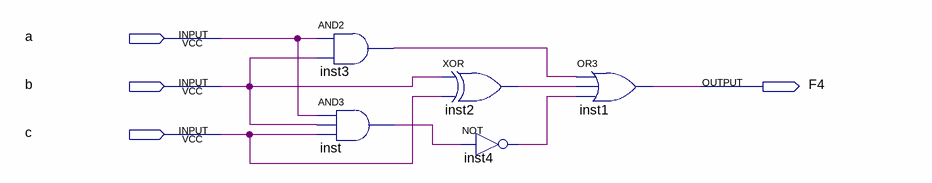
[diagram p0: schematic sheet]
// Quartus schematic Sistema04.bdf as structural Verilog: 5 symbols, 4 pins
module Sistema04 (
  input  a,
  input  b,
  input  c,
  output F4
);

  wire inst2_out, inst3_out, inst4_out, inst_out;

  and inst3 (inst3_out, a, b);
  and inst (inst_out, a, b, c);
  xor inst2 (inst2_out, b, c);
  not inst4 (inst4_out, inst_out);
  or inst1 (F4, inst3_out, inst2_out, inst4_out);
endmodule
